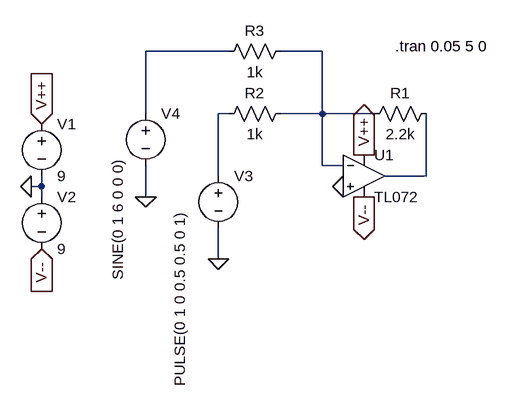
[diagram p0: schematic SumAmp.asc]
SumAmp.asc, the LTspice schematic file:
Version 4
SHEET 1 880 680
WIRE 336 80 208 80
WIRE 480 80 416 80
WIRE 208 176 208 80
WIRE 336 176 320 176
WIRE 480 176 480 80
WIRE 480 176 416 176
WIRE 560 176 480 176
WIRE 480 256 480 176
WIRE 512 256 480 256
WIRE 320 272 320 176
WIRE 640 272 640 176
WIRE 640 272 576 272
WIRE 48 288 48 272
WIRE 48 288 32 288
WIRE 48 304 48 288
WIRE 208 304 208 256
WIRE 320 400 320 352
FLAG 32 288 0
FLAG 48 192 V++
IOPIN 48 192 In
FLAG 48 384 V--
IOPIN 48 384 In
FLAG 320 400 0
FLAG 544 304 V--
IOPIN 544 304 Out
FLAG 544 240 V++
IOPIN 544 240 Out
FLAG 512 288 0
FLAG 208 304 0
SYMBOL Voltage 48 176 R0
SYMATTR InstName V1
SYMATTR Value 9
SYMBOL Voltage 48 288 R0
SYMATTR InstName V2
SYMATTR Value 9
SYMBOL Voltage 320 256 R0
WINDOW 3 -59 70 VRight 2
SYMATTR Value PULSE(0 1 0 0.5 0.5 0 1)
SYMATTR InstName V3
SYMBOL OpAmps/TL072 544 208 R0
SYMATTR InstName U1
SYMBOL Res 656 160 R90
WINDOW 0 0 56 VBottom 2
WINDOW 3 32 56 VTop 2
SYMATTR InstName R1
SYMATTR Value 2.2k
SYMBOL Res 432 160 R90
WINDOW 0 0 56 VBottom 2
WINDOW 3 32 56 VTop 2
SYMATTR InstName R2
SYMATTR Value 1k
SYMBOL Voltage 208 160 R0
WINDOW 3 -43 86 VRight 2
SYMATTR Value SINE(0 1 6 0 0 0)
SYMATTR InstName V4
SYMBOL Res 432 64 R90
WINDOW 0 0 56 VBottom 2
WINDOW 3 32 56 VTop 2
SYMATTR InstName R3
SYMATTR Value 1k
TEXT 592 72 Left 2 !.tran 0.05 5 0

The netlist it stands for:
* SumAmp.asc
V1 V++ 0 9
V2 0 V-- 9
V3 N003 0 PULSE(0 1 0 0.5 0.5 0 1)
XU1 0 N002 V++ V-- N004 TL072  ; pins In+ In- V+ V- OUT
R1 N004 N002 2.2k
R2 N002 N003 1k
V4 N001 0 SINE(0 1 6 0 0 0)
R3 N002 N001 1k
.tran 0.05 5 0
.backanno
.end